# EAGLE design utchattsat_2layer (EAGLE 9.6.2)
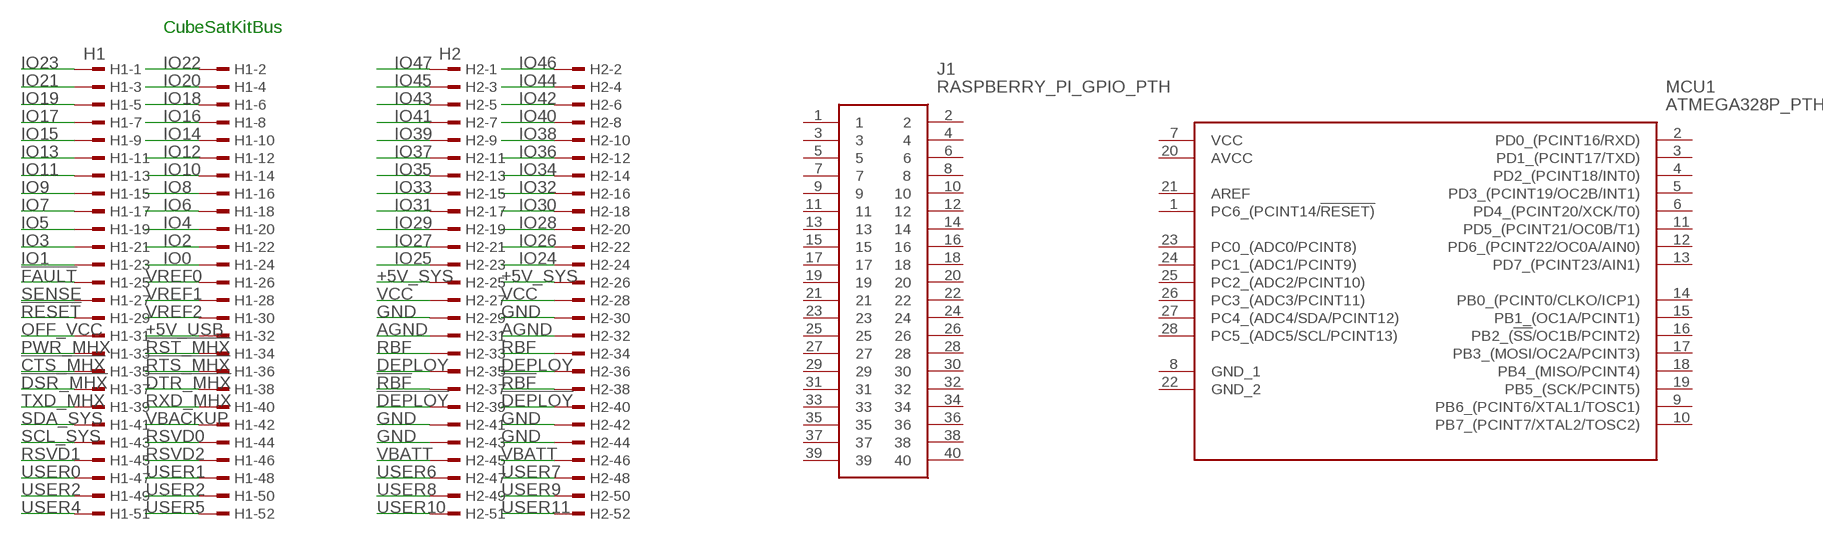
[diagram p0: schematic, sheet 1]

## Parts
H1  H1  TSW-126-07-G-D  [TSW-126-XX-G-D]
H2  H2  TSW-126-07-G-D  [TSW-126-XX-G-D]
J1  RASPBERRY_PI_GPIO_PTH  [RHDR40W64P254_2X20_5130X500X13]
MCU1  ATMEGA328P_PTH  [DIP794W53P254L3467H457Q28N]

## Nets
!CTS_MHX: H1.35
!DEPLOY: H2.39 H2.40
!DSR_MHX: H1.37
!DTR_MHX: H1.38
!FAULT: H1.25
!RBF: H2.37 H2.38
!RESET: H1.29
!RST_MHX: H1.34
!RTS_MHX: H1.36
+5V_SYS: H2.25 H2.26
+5V_USB: H1.32
AGND: H2.31 H2.32
DEPLOY: H2.35 H2.36
GND: H2.29 H2.30 H2.41 H2.42 H2.43 H2.44
IO0: H1.24
IO1: H1.23
IO2: H1.22
IO3: H1.21
IO4: H1.20
IO5: H1.19
IO6: H1.18
IO7: H1.17
IO8: H1.16
IO9: H1.15
IO10: H1.14
IO11: H1.13
IO12: H1.12
IO13: H1.11
IO14: H1.10
IO15: H1.9
IO16: H1.8
IO17: H1.7
IO18: H1.6
IO19: H1.5
IO20: H1.4
IO21: H1.3
IO22: H1.2
IO23: H1.1
IO24: H2.24
IO25: H2.23
IO26: H2.22
IO27: H2.21
IO28: H2.20
IO29: H2.19
IO30: H2.18
IO31: H2.17
IO32: H2.16
IO33: H2.15
IO34: H2.14
IO35: H2.13
IO36: H2.12
IO37: H2.11
IO38: H2.10
IO39: H2.9
IO40: H2.8
IO41: H2.7
IO42: H2.6
IO43: H2.5
IO44: H2.4
IO45: H2.3
IO46: H2.2
IO47: H2.1
OFF_VCC: H1.31
PWR_MHX: H1.33
RBF: H2.33 H2.34
RSVD0: H1.44
RSVD1: H1.45
RSVD2: H1.46
RXD_MHX: H1.40
SCL_SYS: H1.43
SDA_SYS: H1.41
SENSE: H1.27
TXD_MHX: H1.39
USER0: H1.47
USER1: H1.48
USER2: H1.49 H1.50
USER4: H1.51
USER5: H1.52
USER6: H2.47
USER7: H2.48
USER8: H2.49
USER9: H2.50
USER10: H2.51
USER11: H2.52
VBACKUP: H1.42
VBATT: H2.45 H2.46
VCC: H2.27 H2.28
VREF0: H1.26
VREF1: H1.28
VREF2: H1.30
Unconnected: J1.1 J1.2 J1.3 J1.4 J1.5 J1.6 J1.7 J1.8 J1.9 J1.10 J1.11 J1.12 J1.13 J1.14 J1.15 J1.16 J1.17 J1.18 J1.19 J1.20 J1.21 J1.22 J1.23 J1.24 J1.25 J1.26 J1.27 J1.28 J1.29 J1.30 J1.31 J1.32 J1.33 J1.34 J1.35 J1.36 J1.37 J1.38 J1.39 J1.40 MCU1.1(PC6_(PCINT14/!RESET)) MCU1.2(PD0_(PCINT16/RXD)) MCU1.3(PD1_(PCINT17/TXD)) MCU1.4(PD2_(PCINT18/INT0)) MCU1.5(PD3_(PCINT19/OC2B/INT1)) MCU1.6(PD4_(PCINT20/XCK/T0)) MCU1.7(VCC) MCU1.8(GND_1) MCU1.9(PB6_(PCINT6/XTAL1/TOSC1)) MCU1.10(PB7_(PCINT7/XTAL2/TOSC2)) MCU1.11(PD5_(PCINT21/OC0B/T1)) MCU1.12(PD6_(PCINT22/OC0A/AIN0)) MCU1.13(PD7_(PCINT23/AIN1)) MCU1.14(PB0_(PCINT0/CLKO/ICP1)) MCU1.15(PB1_(OC1A/PCINT1)) MCU1.16(PB2_(!SS!/OC1B/PCINT2)) MCU1.17(PB3_(MOSI/OC2A/PCINT3)) MCU1.18(PB4_(MISO/PCINT4)) MCU1.19(PB5_(SCK/PCINT5)) MCU1.20(AVCC) MCU1.21(AREF) MCU1.22(GND_2) MCU1.23(PC0_(ADC0/PCINT8)) MCU1.24(PC1_(ADC1/PCINT9)) MCU1.25(PC2_(ADC2/PCINT10)) MCU1.26(PC3_(ADC3/PCINT11)) MCU1.27(PC4_(ADC4/SDA/PCINT12)) MCU1.28(PC5_(ADC5/SCL/PCINT13))

## Notes on the sheet
- CubeSatKitBus

## Library data of the parts
H1 H2 = con-samtec:TSW-126-*-G: THROUGH-HOLE .025" SQ POST HEADER Source: Samtec TSW.pdf; MF: Samtec Inc.; MPN: TSW-126-07-G-D
J1 = SamacSys_Parts:RASPBERRY_PI_GPIO_PTH: SparkFun Accessories Raspberry Pi GPIO Tall Header - 2x20 Source: Datasheet <https://componentsearchengine.com/Datasheets/1/PRT-14017.pdf>; ARROW_PART_NUMBER: PRT-14017; ARROW_PRICE-STOCK: https://www.arrow.com/en/products/prt-14017/sparkfun-electronics; DESCRIPTION: SparkFun Accessories Raspberry Pi GPIO Tall Header - 2x20; HEIGHT: 13.75mm; MANUFACTURER_NAME: SparkFun; MANUFACTURER_PART_NUMBER: PRT-14017; MOUSER_PART_NUMBER: 474-PRT-14017; MOUSER_PRICE-STOCK: https://www.mouser.co.uk/ProductDetail/SparkFun/PRT-14017/?qs=a4BXICGgSn%2F%252BaML822b65A%3D%3D
MCU1 = SamacSys_Parts:ATMEGA328P_PTH: MICROCHIP - ATMEGA328P-PU. - MICROCONTROLLER MCU, 8 BIT, ATMEGA, 20MHZ, DIP-28 Source: Datasheet <http://ww1.microchip.com/downloads/en/DeviceDoc/Atmel-42735-8-bit-AVR-Microcontroller-ATmega328-328P_Datasheet.pdf>; ARROW_PART_NUMBER: ATMEGA328P-PU; ARROW_PRICE-STOCK: https://www.arrow.com/en/products/atmega328p-pu/microchip-technology; DESCRIPTION: MICROCHIP - ATMEGA328P-PU. - MICROCONTROLLER MCU, 8 BIT, ATMEGA, 20MHZ, DIP-28; HEIGHT: 4.572mm; MANUFACTURER_NAME: Microchip; MANUFACTURER_PART_NUMBER: ATMEGA328P-PU; MOUSER_PART_NUMBER: 556-ATMEGA328P-PU; MOUSER_PRICE-STOCK: https://www.mouser.co.uk/ProductDetail/Microchip-Technology-Atmel/ATMEGA328P-PU?qs=K8BHR703ZXguOQv3sKbWcg%3D%3D

## Net classes
0 default: width 0.254 mm, drill 0.9 mm, clearance 0.254 mm
1 power: width 0.381 mm, drill 0.9 mm, clearance 0.254 mm
2 gnd: width 0.254 mm, drill 0.9 mm, clearance 0.254 mm
3 usbvcc: width 0.381 mm, drill 0.9 mm, clearance 0.254 mm
4 aref: width 0.254 mm, drill 0.9 mm, clearance 0.254 mm

## Board
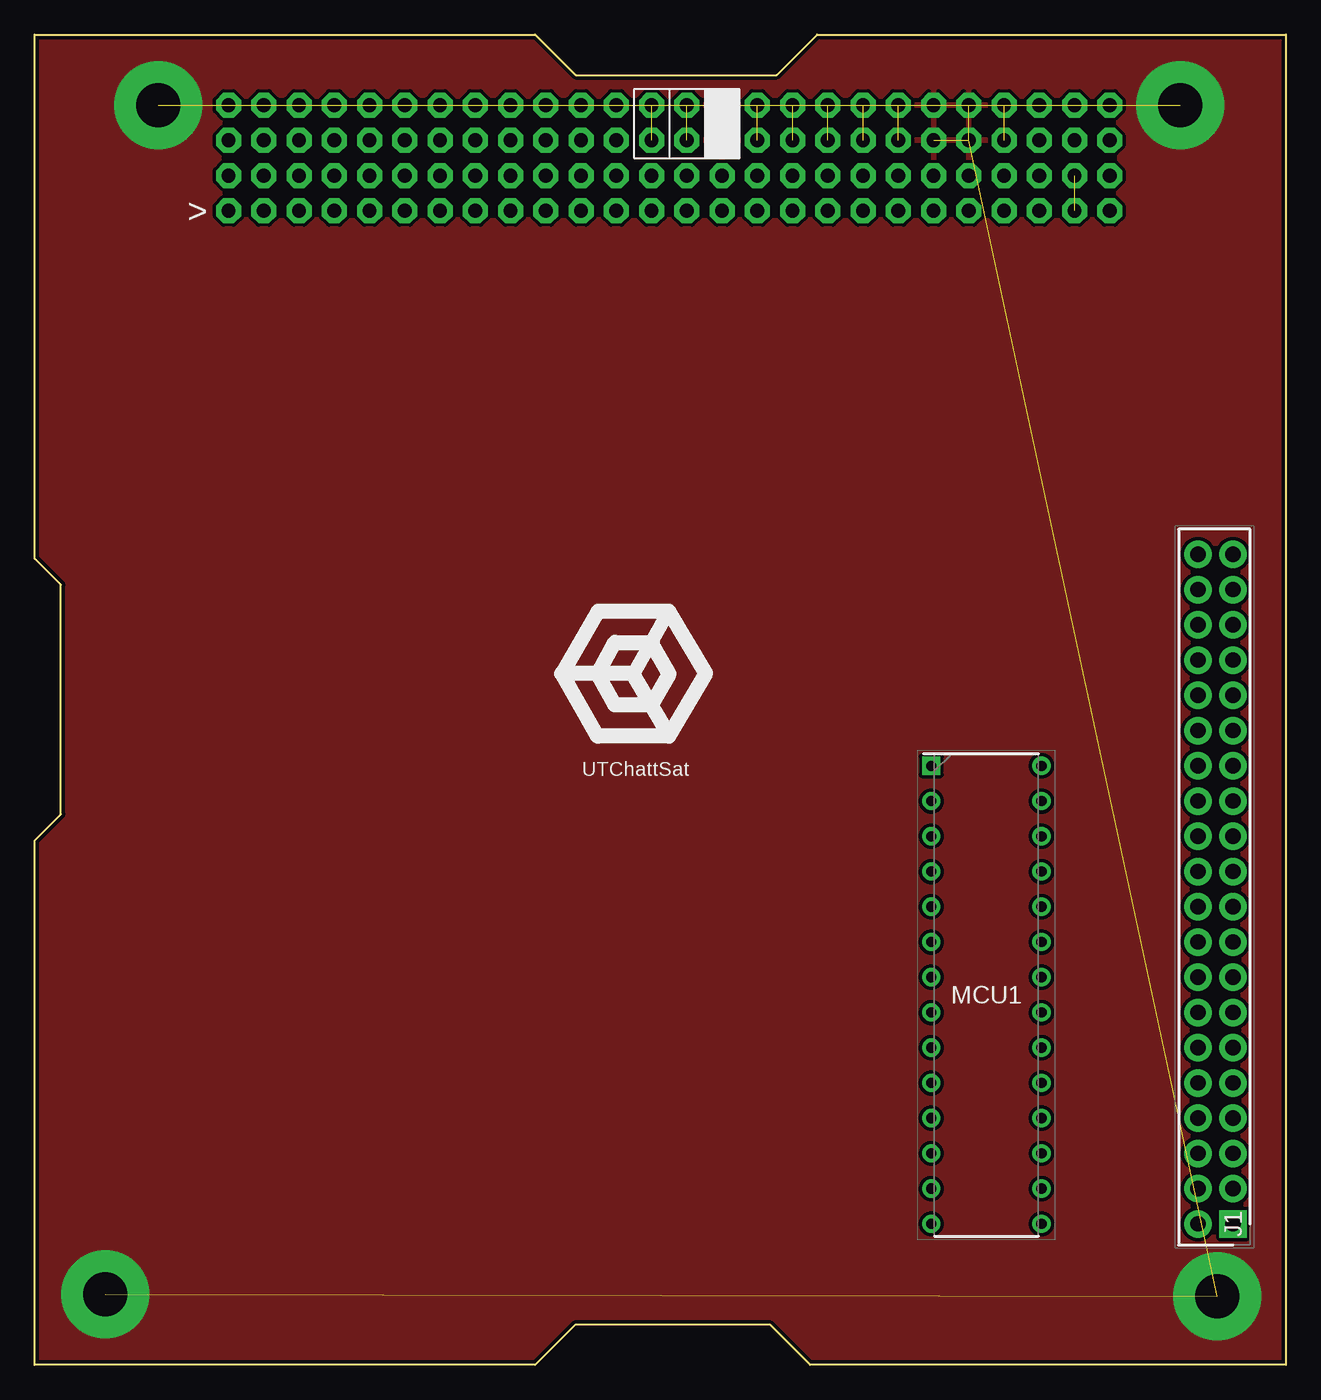
[diagram p1: board, top side]
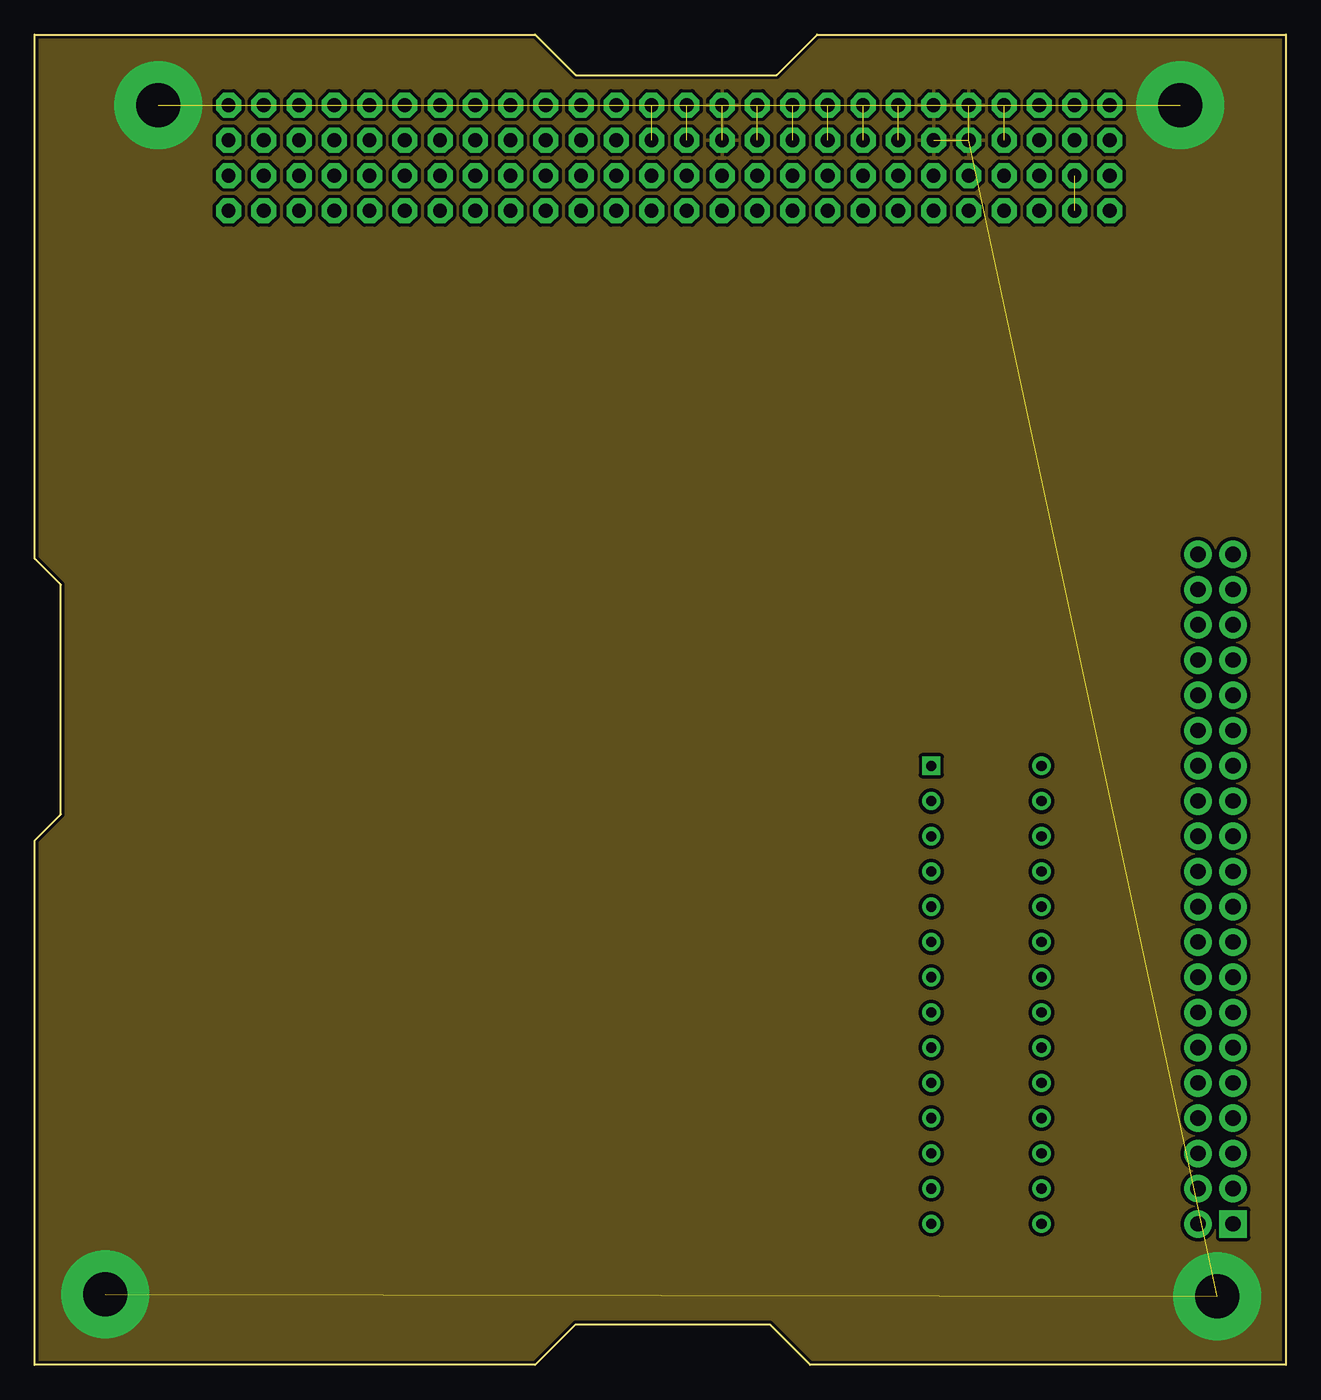
[diagram p2: board, inner layer DO_NOT_USE]
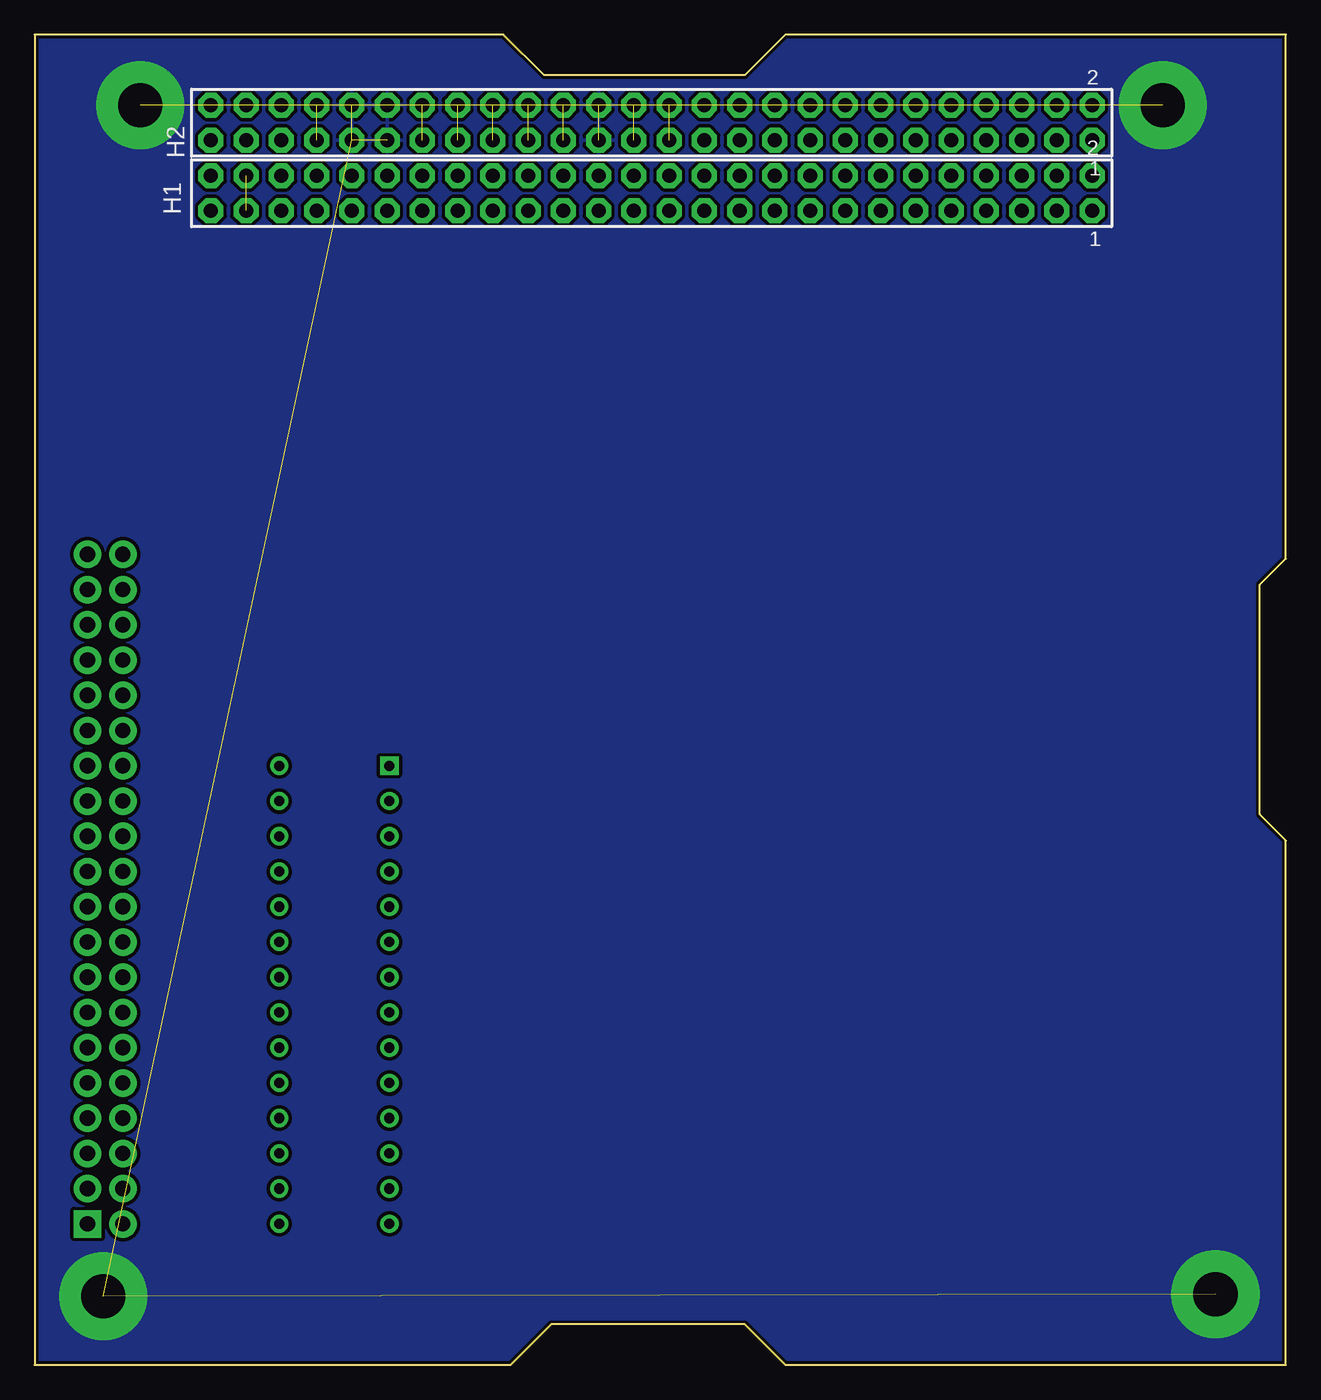
[diagram p3: board, bottom side, seen from below]

Size 90.17 x 95.89 mm. Coordinates in mm from the lower left corner, seen from the top.
Outline: 0,0 0,37.8 1.88,39.67 1.88,56.24 0,58.12 0,95.89 36.07,95.89 38.99,92.96 53.47,92.96 56.39,95.89 90.17,95.89 90.17,0 55.88,0 52.96,2.92 38.99,2.92 36.07,0 0,0
Copper layers (1*16): Top 0.035mm / dielectric 1.6mm / Bottom 0.035mm
Design rules "jlcpcb-2layers *": minimum track width 5mil, minimum drill 0.3mm, track to track 5mil, track to pad 5mil, pad to pad 5mil, via to via 5mil, smd to smd 5mil, copper to edge 0.2mm, drill to drill 6mil, minimum pad ring 10mil, minimum via ring 3mil, stop-mask expansion 4mil, vias tented up to drill 0mil, thermal gap 10mil

### Footprints (pad centres in the part's own frame; a part is rotated, then mirrored left to right if it is on the bottom)
TSW-126-XX-G-D = drill 1 pad 1.5 octagon: 1 31.75,-1.27; 2 31.75,1.27; 3 29.21,-1.27; 4 29.21,1.27; 5 26.67,-1.27; 6 26.67,1.27; 7 24.13,-1.27; 8 24.13,1.27; 9 21.59,-1.27; 10 21.59,1.27; 11 19.05,-1.27; 12 19.05,1.27; 13 16.51,-1.27; 14 16.51,1.27; 15 13.97,-1.27; 16 13.97,1.27; 17 11.43,-1.27; 18 11.43,1.27; 19 8.89,-1.27; 20 8.89,1.27; 21 6.35,-1.27; 22 6.35,1.27; 23 3.81,-1.27; 24 3.81,1.27; 25 1.27,-1.27; 26 1.27,1.27; 27 -1.27,-1.27; 28 -1.27,1.27; 29 -3.81,-1.27; 30 -3.81,1.27; 31 -6.35,-1.27; 32 -6.35,1.27; 33 -8.89,-1.27; 34 -8.89,1.27; 35 -11.43,-1.27; 36 -11.43,1.27; 37 -13.97,-1.27; 38 -13.97,1.27; 39 -16.51,-1.27; 40 -16.51,1.27; 41 -19.05,-1.27; 42 -19.05,1.27; 43 -21.59,-1.27; 44 -21.59,1.27; 45 -24.13,-1.27; 46 -24.13,1.27; 47 -26.67,-1.27; 48 -26.67,1.27; 49 -29.21,-1.27; 50 -29.21,1.27; 51 -31.75,-1.27; 52 -31.75,1.27
RHDR40W64P254_2X20_5130X500X13 = drill 1.1 pad 1.65 square: 1 0,0 | drill 1.1 pad 1.65: 2 0,2.54; 3 2.54,0; 4 2.54,2.54; 5 5.08,0; 6 5.08,2.54; 7 7.62,0; 8 7.62,2.54; 9 10.16,0; 10 10.16,2.54; 11 12.7,0; 12 12.7,2.54; 13 15.24,0; 14 15.24,2.54; 15 17.78,0; 16 17.78,2.54; 17 20.32,0; 18 20.32,2.54; 19 22.86,0; 20 22.86,2.54; 21 25.4,0; 22 25.4,2.54; 23 27.94,0; 24 27.94,2.54; 25 30.48,0; 26 30.48,2.54; 27 33.02,0; 28 33.02,2.54; 29 35.56,0; 30 35.56,2.54; 31 38.1,0; 32 38.1,2.54; 33 40.64,0; 34 40.64,2.54; 35 43.18,0; 36 43.18,2.54; 37 45.72,0; 38 45.72,2.54; 39 48.26,0; 40 48.26,2.54
DIP794W53P254L3467H457Q28N = drill 0.733 pad 1.133 square: 1 -3.969,16.51 | drill 0.733 pad 1.133: 2 -3.969,13.97; 3 -3.969,11.43; 4 -3.969,8.89; 5 -3.969,6.35; 6 -3.969,3.81; 7 -3.969,1.27; 8 -3.969,-1.27; 9 -3.969,-3.81; 10 -3.969,-6.35; 11 -3.969,-8.89; 12 -3.969,-11.43; 13 -3.969,-13.97; 14 -3.969,-16.51; 15 3.969,-16.51; 16 3.969,-13.97; 17 3.969,-11.43; 18 3.969,-8.89; 19 3.969,-6.35; 20 3.969,-3.81; 21 3.969,-1.27; 22 3.969,1.27; 23 3.969,3.81; 24 3.969,6.35; 25 3.969,8.89; 26 3.969,11.43; 27 3.969,13.97; 28 3.969,16.51

### Placement (x,y rotation side)
H1  45.72,84.45 0 bottom
H2  45.72,89.53 0 bottom
J1  86.36,10.16 90 top
MCU1  68.58,26.67 0 top

### Tracks (layer width: path | path; a pad name or v marks a point on that pad's centre or on a via)
!DEPLOY  (1 unrouted)
!RBF  (1 unrouted)
+5V_SYS  (1 unrouted)
AGND  (1 unrouted)
DEPLOY  (1 unrouted)
GND  (via drill 3.17 pad 6.35)  (9 unrouted)
  other vias: 5.08,5.08 8.89,90.81 82.55,90.81 85.22,4.95
  pour Top (isolate 0.254): 0,0 0,37.8 1.88,39.67 1.88,56.24 0,58.12 0,95.89 36.07,95.89 38.99,92.96 53.47,92.96 56.39,95.89 90.17,95.89 90.17,0 55.88,0 52.96,2.92 38.99,2.92 36.07,0
  pour DO_NOT_USE: 0,96.01 0,58.17 2.03,56.13 2.03,39.88 0,37.85 0,0 36.07,0 38.86,2.79 53.09,2.79 55.88,0 56.13,0 90.17,0 90.17,95.76 56.13,95.76 53.34,92.96 38.86,92.96 36.07,95.76 1.52,95.76
  pour Bottom: 0,96.52 90.17,96.52 90.17,0 0,0
RBF  (1 unrouted)
USER2  (1 unrouted)
VBATT  (1 unrouted)
VCC  (1 unrouted)

### Text on the board
tPlace: > | UTChattSat